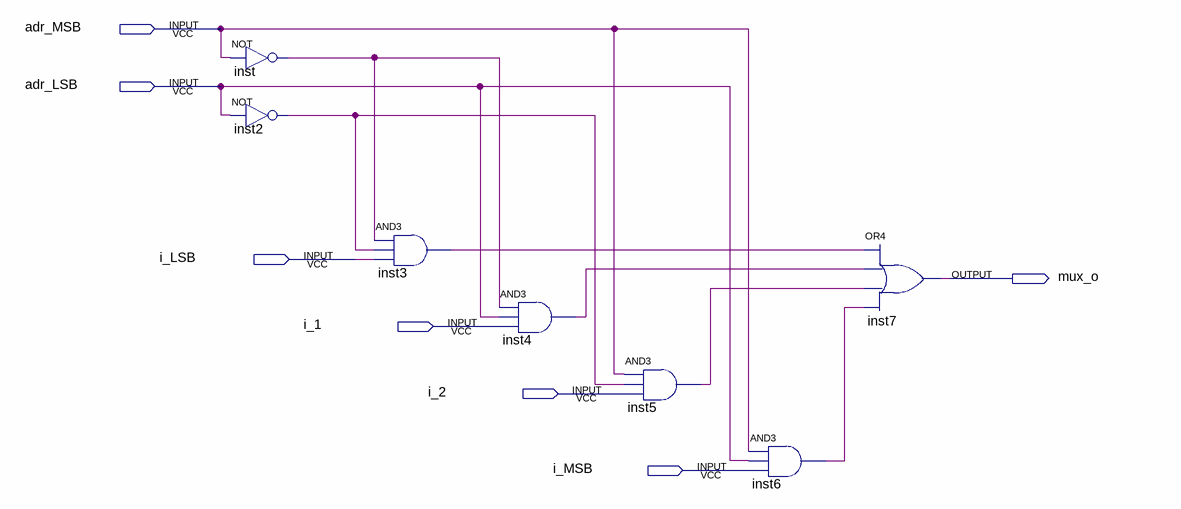
[diagram p0: schematic sheet]
// Quartus schematic mux.bdf as structural Verilog: 7 symbols, 7 pins
module mux (
  input  adr_MSB,
  input  adr_LSB,
  input  i_LSB,
  input  i_1,
  input  i_2,
  input  i_MSB,
  output mux_o
);

  wire inst2_out, inst3_out, inst4_out, inst5_out, inst6_out, inst_out;

  not inst (inst_out, adr_MSB);
  not inst2 (inst2_out, adr_LSB);
  and inst3 (inst3_out, inst_out, inst2_out, i_LSB);
  and inst4 (inst4_out, inst_out, adr_LSB, i_1);
  and inst5 (inst5_out, adr_MSB, inst2_out, i_2);
  and inst6 (inst6_out, adr_MSB, adr_LSB, i_MSB);
  or inst7 (mux_o, inst3_out, inst4_out, inst5_out, inst6_out);
endmodule
